# EAGLE schematic SLA_1500_CAM_V2 (EAGLE 9.2.1)
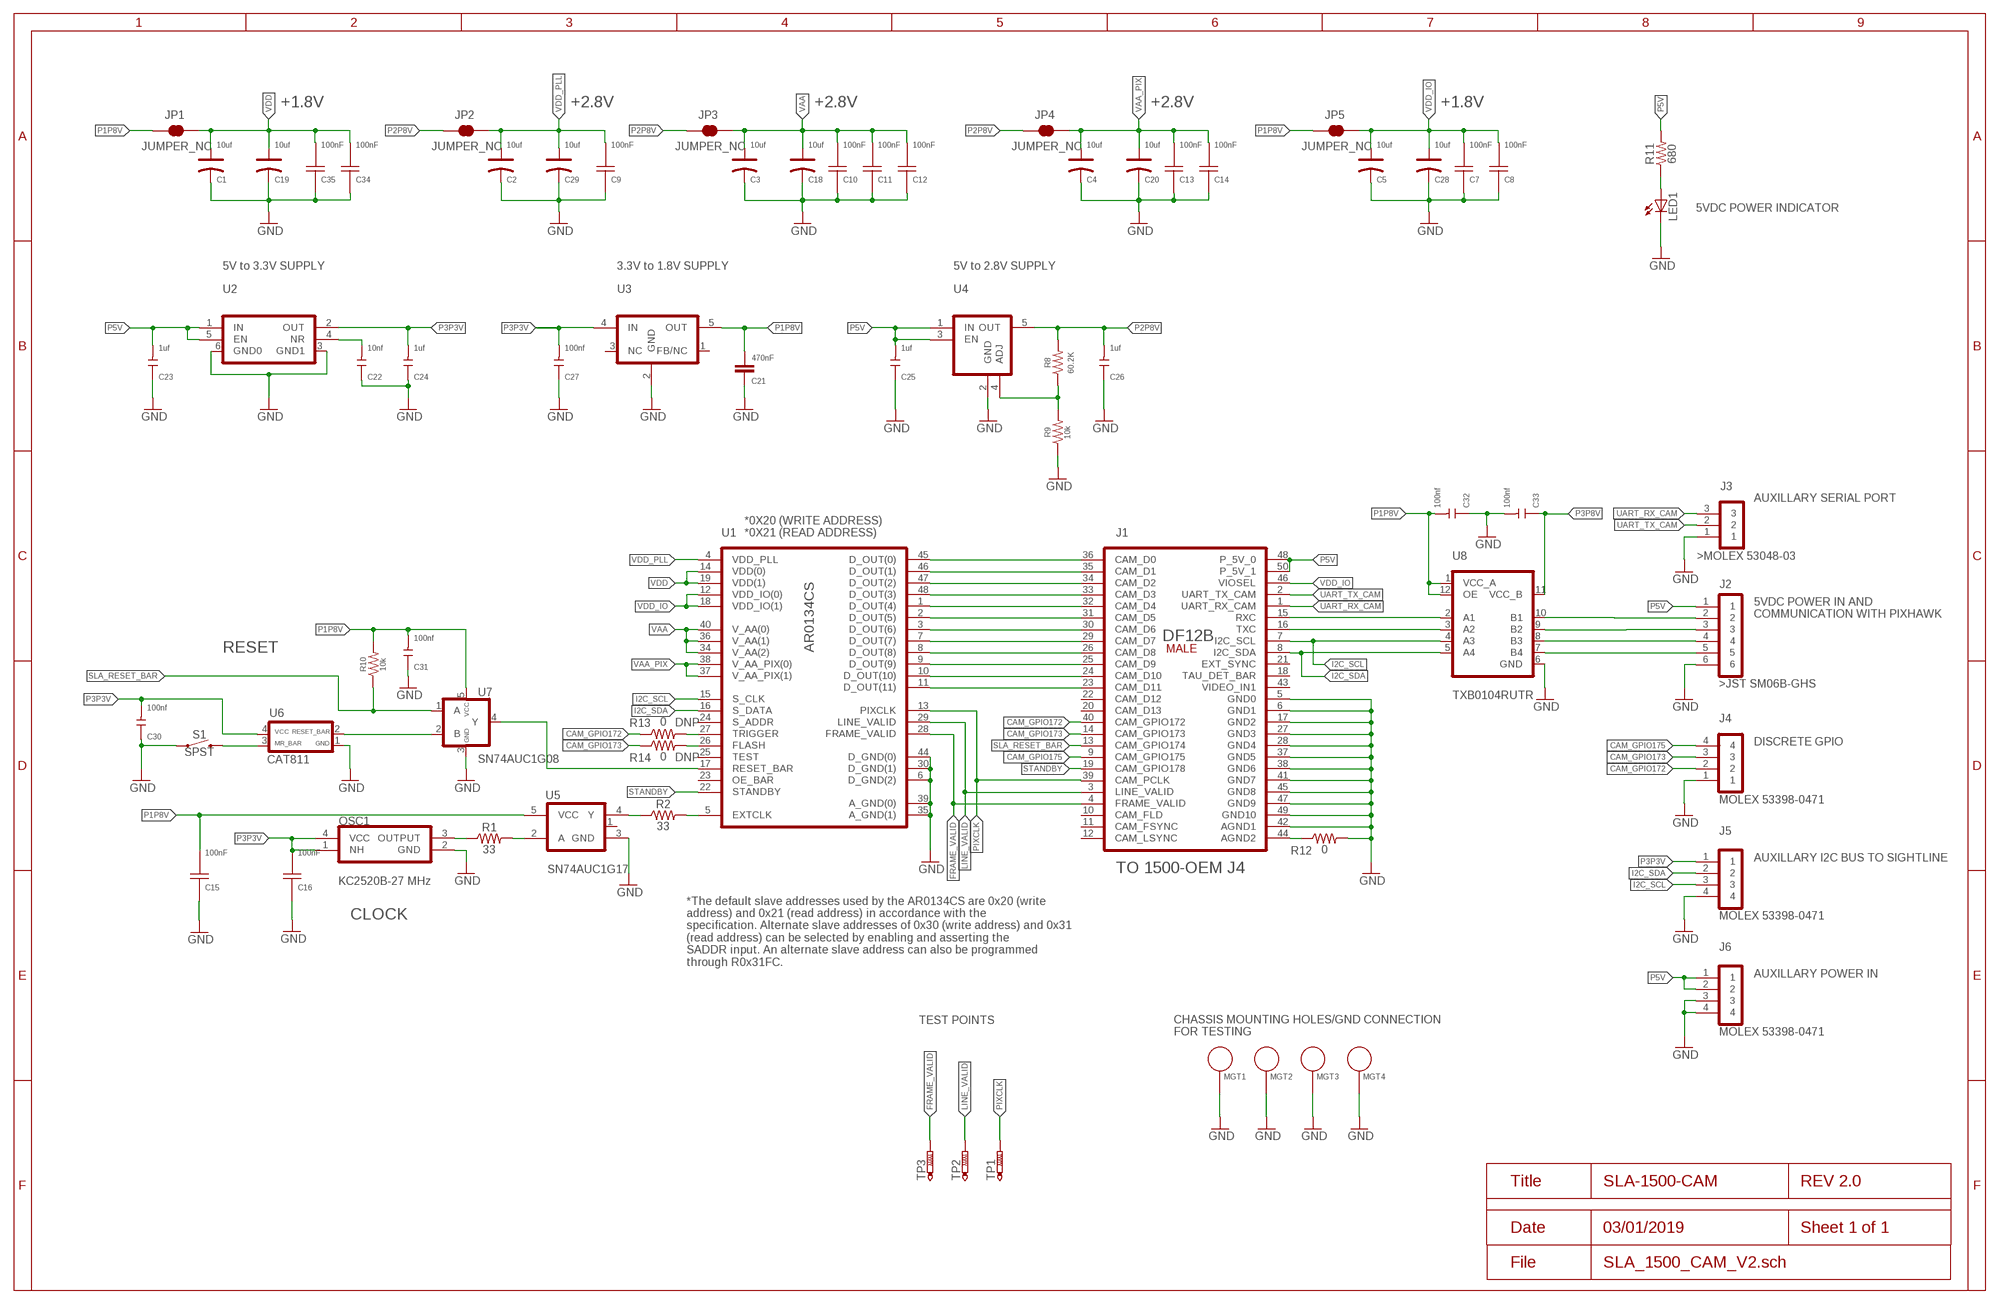
[diagram p0: schematic, sheet 1]
FRAME1 (FRAME_B_L): SPICEPREFIX: X

## Parts
C1  10uf  TANTALUM-SMD-10UF-10V-10%(AVX-A)  [AVX-A]
C2  10uf  TANTALUM-SMD-10UF-10V-10%(AVX-A)  [AVX-A]
C3  10uf  TANTALUM-SMD-10UF-10V-10%(AVX-A)  [AVX-A]
C4  10uf  TANTALUM-SMD-10UF-10V-10%(AVX-A)  [AVX-A]
C5  10uf  TANTALUM-SMD-10UF-10V-10%(AVX-A)  [AVX-A]
C7  CAP0201100NF  [R0201]
C8  CAP0201100NF  [R0201]
C9  CAP0201100NF  [R0201]
C10  CAP0201100NF  [R0201]
C11  CAP0201100NF  [R0201]
C12  CAP0201100NF  [R0201]
C13  CAP0201100NF  [R0201]
C14  CAP0201100NF  [R0201]
C15  CAP0201100NF  [R0201]
C16  CAP0201100NF  [R0201]
C18  10uf  TANTALUM-SMD-10UF-10V-10%(AVX-A)  [AVX-A]
C19  10uf  TANTALUM-SMD-10UF-10V-10%(AVX-A)  [AVX-A]
C20  10uf  TANTALUM-SMD-10UF-10V-10%(AVX-A)  [AVX-A]
C21  470nF  470NF-0402-16V-10%  [0402]
C22  10nf  CERAMIC-10NF-50V-10%-X7R(0402)  [C0402]
C23  1uf  CERAMIC-1UF-10V-10%-X5R(0402)  [C0402]
C24  1uf  CERAMIC-1UF-10V-10%-X5R(0402)  [C0402]
C25  1uf  CERAMIC-1UF-10V-10%-X5R(0402)  [C0402]
C26  1uf  CERAMIC-1UF-10V-10%-X5R(0402)  [C0402]
C27  100nf  CERAMIC-100NF-25V-10%-X7R(0402)  [C0402]
C28  10uf  TANTALUM-SMD-10UF-10V-10%(AVX-A)  [AVX-A]
C29  10uf  TANTALUM-SMD-10UF-10V-10%(AVX-A)  [AVX-A]
C30  100nf  CERAMIC-100NF-25V-10%-X7R(0402)  [C0402]
C31  100nf  CERAMIC-100NF-25V-10%-X7R(0402)  [C0402]
C32  100nf  CERAMIC-100NF-25V-10%-X7R(0402)  [C0402]
C33  100nf  CERAMIC-100NF-25V-10%-X7R(0402)  [C0402]
C34  CAP0201100NF  [R0201]
C35  CAP0201100NF  [R0201]
J1  DF12B(5.0)-50DS-0.5(86)SMT  [DF12B(5.0)-50DS-0.5V(86)]
J2  JST_GH_SM06B-GHS-TB  [JST_SM06B-GHS-TB]
J3  MOLEX_53048-03  [53048-03]
J4  MOLEX 53398-0471  MOLEX_53398-04  [53398-04]
J5  MOLEX 53398-04  MOLEX_53398-04  [53398-04]
J6  MOLEX_53398-04  [53398-04]
JP1  JUMPER_NC  JUMPER-SMT_2_NC_TRACE_SILK  [SMT-JUMPER_2_NC_TRACE_SILK]
JP2  JUMPER_NC  JUMPER-SMT_2_NC_TRACE_SILK  [SMT-JUMPER_2_NC_TRACE_SILK]
JP3  JUMPER_NC  JUMPER-SMT_2_NC_TRACE_SILK  [SMT-JUMPER_2_NC_TRACE_SILK]
JP4  JUMPER_NC  JUMPER-SMT_2_NC_TRACE_SILK  [SMT-JUMPER_2_NC_TRACE_SILK]
JP5  JUMPER_NC  JUMPER-SMT_2_NC_TRACE_SILK  [SMT-JUMPER_2_NC_TRACE_SILK]
LED1  LEDCHIP-LED0603  [CHIP-LED0603]
MGT1  MOUNTING_HOLE  [BEAGLEBONEBLACK_MOUNTING_HOLE]
MGT2  MOUNTING_HOLE  [BEAGLEBONEBLACK_MOUNTING_HOLE]
MGT3  MOUNTING_HOLE  [BEAGLEBONEBLACK_MOUNTING_HOLE]
MGT4  MOUNTING_HOLE  [BEAGLEBONEBLACK_MOUNTING_HOLE]
OSC1  KC2520B-27MHZ  [2.5X2.0_SMDCRYSTAL]
R1  33  RESISTOR0402  [0402]
R2  33  RESISTOR0402  [0402]
R8  60.2K  62KOHM-0603-1/10W-5%  [0603]
R9  10k  10KOHM-0603-1/10W-1%  [0603]
R10  10k  10KOHM-0603-1/10W-1%  [0603]
R11  680  680OHM-0603-1/10W-5%  [0603]
R12  0  RESISTOR0402  [0402]
R13  0  RESISTOR0402  [0402]
R14  0  RESISTOR0402  [0402]
S1  SPST  MOMENTARY-SWITCH-SPST-SMD-4.6X2.8MM  [TACTILE_SWITCH_SMD_4.6X2.8MM]
TP1  PTR1PAD1-13  [P1-13]
TP2  PTR1PAD1-13  [P1-13]
TP3  PTR1PAD1-13  [P1-13]
U1  AR0134CS-ILCC48  [ILCC48]
U2  TPS73633DCQR  [SOT-223-6-PIN]
U3  TPS71518DCKR  [TI-SC70-5]
U4  AP7331-WG-7  [SOT-25]
U5  SN74AUC1G17  [SOT23-5]
U6  CAT811  [SOT-143-4]
U7  SN74AUC1G08  [SOT23-5]
U8  TXB0104RUTR  [UQFN-12]

## Nets
CAM_GPIO172: J1.40(CAM_GPIO172) J4.2 R13.1
CAM_GPIO173: J1.14(CAM_GPIO173) J4.3 R14.1
CAM_GPIO175: J1.9(CAM_GPIO175) J4.4
FRAME_VALID: J1.4(FRAME_VALID) TP3.TP U1.28(FRAME_VALID)
GND: C1.- C2.- C3.- C4.- C5.- C7.2 C8.2 C9.2 C10.2 C11.2 C12.2 C13.2 C14.2 C15.2 C16.2 C18.- C19.- C20.- C21.2 C22.1 C23.1 C24.1 C25.1 C26.1 C27.1 C28.- C29.- C30.1 C31.1 C32.1 C33.2 C34.2 C35.2 J1.5(GND0) J1.6(GND1) J1.17(GND2) J1.27(GND3) J1.28(GND4) J1.37(GND5) J1.38(GND6) J1.41(GND7) J1.42(AGND1) J1.45(GND8) J1.47(GND9) J1.49(GND10) J2.6 J3.1 J4.1 J5.4 J6.3 J6.4 LED1.C MGT1.P$1 MGT2.P$1 MGT3.P$1 MGT4.P$1 OSC1.2(GND) R9.1 R12.2 S1.1 S1.2 U1.6(D_GND(2)) U1.30(D_GND(1)) U1.35(A_GND(1)) U1.39(A_GND(0)) U1.44(D_GND(0)) U2.3(GND1) U2.6(GND0) U3.2(GND) U4.2(GND) U5.3(GND) U6.1(GND) U7.3(GND) U8.6(GND)
I2C_SCL: J1.7(I2C_SCL) J5.3 U1.15(S_CLK) U8.4(A3)
I2C_SDA: J1.8(I2C_SDA) J5.2 U1.16(S_DATA) U8.5(A4)
LINE_VALID: J1.3(LINE_VALID) TP2.TP U1.29(LINE_VALID)
N$4: J1.23(CAM_D11) U1.11(D_OUT(11))
N$5: J1.24(CAM_D10) U1.10(D_OUT(10))
N$6: J1.25(CAM_D9) U1.9(D_OUT(9))
N$7: J1.26(CAM_D8) U1.8(D_OUT(8))
N$8: J1.29(CAM_D7) U1.7(D_OUT(7))
N$9: J1.30(CAM_D6) U1.3(D_OUT(6))
N$10: J1.31(CAM_D5) U1.2(D_OUT(5))
N$11: J1.32(CAM_D4) U1.1(D_OUT(4))
N$12: J1.33(CAM_D3) U1.48(D_OUT(3))
N$14: J1.34(CAM_D2) U1.47(D_OUT(2))
N$15: R1.2 U5.2(A)
N$16: OSC1.3(OUTPUT) R1.1
N$17: J1.15(RXC) U8.2(A1)
N$18: J2.3 U8.9(B2)
N$19: J2.5 U8.7(B4)
N$20: J2.2 U8.10(B1)
N$21: C22.2 U2.4(NR)
N$22: J1.35(CAM_D1) U1.46(D_OUT(1))
N$23: R8.1 R9.2 U4.4(ADJ)
N$24: J1.36(CAM_D0) U1.45(D_OUT(0))
N$25: R2.1 U5.4(Y)
N$26: R2.2 U1.5(EXTCLK)
N$27: S1.3 S1.4 U6.3(MR_BAR)
N$28: U6.2(RESET_BAR) U7.2(B)
N$29: U1.17(RESET_BAR) U7.4(Y)
N$30: LED1.A R11.1
N$31: J1.44(AGND2) R12.1
N$32: R13.2 U1.27(TRIGGER)
N$33: R14.2 U1.26(FLASH)
N$34: J1.16(TXC) U8.3(A2)
N$36: J2.4 U8.8(B3)
P1P8V: C15.1 C21.1 C31.2 C32.2 JP1.1 JP5.1 R10.2 U3.5(OUT) U5.5(VCC) U7.5(VCC) U8.1(VCC_A) U8.12(OE)
P2P8V: C26.2 JP2.1 JP3.1 JP4.1 R8.2 U4.5(OUT)
P3P3V: C16.1 C24.2 C27.2 C30.2 J5.1 OSC1.1(NH) OSC1.4(VCC) U2.2(OUT) U3.4(IN) U6.4(VCC)
P3P8V: C33.1 U8.11(VCC_B)
P5V: C23.2 C25.2 J1.48(P_5V_0) J1.50(P_5V_1) J2.1 J6.1 J6.2 R11.2 U2.1(IN) U2.5(EN) U4.1(IN) U4.3(EN)
PIXCLK: J1.39(CAM_PCLK) TP1.TP U1.13(PIXCLK)
SLA_RESET_BAR: J1.13(CAM_GPIO174) R10.1 U7.1(A)
STANDBY: J1.19(CAM_GPIO178) U1.22(STANDBY)
UART_RX_CAM: J1.1(UART_RX_CAM) J3.3
UART_TX_CAM: J1.2(UART_TX_CAM) J3.2
VAA: C3.+ C10.1 C11.1 C12.1 C18.+ JP3.2 U1.34(V_AA(2)) U1.36(V_AA(1)) U1.40(V_AA(0))
VAA_PIX: C4.+ C13.1 C14.1 C20.+ JP4.2 U1.37(V_AA_PIX(1)) U1.38(V_AA_PIX(0))
VDD: C1.+ C19.+ C34.1 C35.1 JP1.2 U1.14(VDD(0)) U1.19(VDD(1))
VDD_IO: C5.+ C7.1 C8.1 C28.+ J1.46(VIOSEL) JP5.2 U1.12(VDD_IO(0)) U1.18(VDD_IO(1))
VDD_PLL: C2.+ C9.1 C29.+ JP2.2 U1.4(VDD_PLL)
Unconnected: J1.10(CAM_FLD) J1.11(CAM_FSYNC) J1.12(CAM_LSYNC) J1.18(TAU_DET_BAR) J1.20(CAM_D13) J1.21(EXT_SYNC) J1.22(CAM_D12) J1.43(VIDEO_IN1) U1.23(OE_BAR) U1.24(S_ADDR) U1.25(TEST) U3.1(FB/NC) U3.3(NC) U5.1(NC)

## Notes on the sheet
- +1.8V | +2.8V | +2.8V | +2.8V | +1.8V
- 5VDC POWER INDICATOR
- 5V to 3.3V SUPPLY | 3.3V to 1.8V SUPPLY | 5V to 2.8V SUPPLY
- AUXILLARY SERIAL PORT
- *0X20 (WRITE ADDRESS)
  *0X21 (READ ADDRESS)
- 5VDC POWER IN AND 
  COMMUNICATION WITH PIXHAWK
- RESET
- DNP
- DISCRETE GPIO
- DNP
- MOLEX 53398-0471
- AUXILLARY I2C BUS TO SIGHTLINE
- TO 1500-OEM J4
- CLOCK | MOLEX 53398-0471
- *The default slave addresses used by the AR0134CS are 0x20 (write
  address) and 0x21 (read address) in accordance with the
  specification. Alternate slave addresses of 0x30 (write address) and 0x31 
  (read address) can be selected by enabling and asserting the
  SADDR input. An alternate slave address can also be programmed
  through R0x31FC.
- AUXILLARY POWER IN
- TEST POINTS
- CHASSIS MOUNTING HOLES/GND CONNECTION
  FOR TESTING
- MOLEX 53398-0471

## Library data of the parts
C1-C5 C18-C20 C28 C29 = Seeed-Capacitor:TANTALUM-SMD-10UF-10V-10%(AVX-A): 302020011; MPN: TAJA106K010RNJ
C7-C16 C34 C35 = Sightline:CAP0201: CAP0201 PANASONIC CERAMIC CAPACITOR CAP, CERAMIC, 100nF, 10V, X5R, 20%, 0201; DESCRIPTION: CAP, CERAMIC, 100nF, 10V, X5R, 20%, 0201; MANF: PANASONIC; MANF#: ECJZEB1A104M
C21 = SparkFun-Capacitors:470NF: 0.47uF/470nF ceramic capacitors A capacitor is a passive two-terminal electrical component used to store electrical energy temporarily in an electric field.; PROD_ID: CAP-09041
C22 = Seeed-Capacitor:CERAMIC-10NF-50V-10%-X7R(0402): 302010006; MPN: CC0402KRX7R9BB103
C23-C26 = Seeed-Capacitor:CERAMIC-1UF-10V-10%-X5R(0402): 302010040; MPN: CC0402KRX5R6BB105
C27 C30-C33 = Seeed-Capacitor:CERAMIC-100NF-25V-10%-X7R(0402): 302010024; MPN: CC0402KRX7R8BB104
J1 = Sightline:DF12B(5.0)-50DS-0.5(86): DF12B(5.0)-50DS-0.5(86) DF12 Series 0.5 mm Pitch SMT Board-to-Board Connector (MALE) Specifications Manufacturer: Hirose Manufacturer Part Number: 537-0309-6 86 Operating Temperature Range(C): -45 - 125 Current Rating: 0.3A Voltage Rating: 50V AC Body Size(mm): 14.6 x 3.6 DF12B(5.0)-50DS DATASHEET <https://www.hirose.com/product/en/products/DF12/> Created by: Kimball S. Davis kimball4@pdx.edu <mailto: kimball4@pdx.edu> 21 January 2019 Version 001; DESCRIPTION: DF12B-50DS-0.5V(86) Hirose Male 50-pin connector; MANF: Hirose; MANF#: 537-0309-6 86
J2 = Sightline:JST_GH_SM06B-GHS-TB: JST SM06B-GHS-TB JST Type GH 1.25mm side-entry smt 6-pin connector Specifications Manufacturer: JST Manufacturer Part Number: SM06B-GHS-TB Body Size(mm): 10.75 X 4.25 JST TYPE GH DATASHEET <http://www.jst-mfg.com/product/pdf/eng/eGH.pdf> Created by: Kimball S. Davis 5 February 2019 Version 001; DESCRIPTION: 1.25 MM SIDE-ENTRY 6-PIN SMT CONNECTOR; MANF: JST; MANF#: SM06B-GHS-TB
J3 = Sightline:MOLEX_53048-03; DESCRIPTION: MOLEX 53048-03 3-PIN CONNECTOR; MANF: MOLEX; MANF#: 53048-0310
J4-J6 = Sightline:MOLEX_53398-04: MOLEX 53398-0471 1.25mm Pitch PicoBlade Header, Surface Mount, Vertical, 4 Circuits MOLEX 53398-0471 DATASHEET <https://www.molex.com/webdocs/datasheets/pdf/en-us/0533980471_PCB_HEADERS.pdf>; DESCRIPTION: MOLEX 53398-04 4-PIN SMT CONNECTOR; MANF: MOLEX; MANF#: 53398-0471
JP1-JP5 = SparkFun-Jumpers:JUMPER-SMT_2_NC_TRACE: Normally closed trace jumper This jumper has a trace between two pads so it's normally closed (NC). Use a razor knife to open the connection. For best results follow the IPC guidelines for cutting traces: Cutout at least 0.063 mm (0.005 in). Remove all loose material to clean up the cut area. Seal the cut with an approved epoxy. Reapply solder to reclose the connection.
LED1 = led:LED: LED OSRAM: - CHIPLED LG R971, LG N971, LY N971, LG Q971, LY Q971, LO R971, LY R971 LH N974, LH R974 LS Q976, LO Q976, LY Q976 LO Q996 - Hyper CHIPLED LW Q18S LB Q993, LB Q99A, LB R99A - SideLED LS A670, LO A670, LY A670, LG A670, LP A670 LB A673, LV A673, LT A673, LW A673 LH A674 LY A675 LS A676, LA A676, LO A676, LY A676, LW A676 LS A679, LY A679, LG A679 - Hyper Micro SIDELED® LS Y876, LA Y876, LO Y876, LY Y876 LT Y87S - SmartLED LW L88C, LW L88S LB L89C, LB L89S, LG L890 LS L89K, LO L89K, LY L89K LS L896, LA L896, LO L896, LY L896 - TOPLED LS T670, LO T670, LY T670, LG T670, LP T670 LSG T670, LSP T670, LSY T670, LOP T670, LYG T670 LG T671, LOG T671, LSG T671 LB T673, LV T673, LT T673, LW T673 LH T674 LS T676, LA T676, LO T676, LY T676, LB T676, LH T676, LSB T676, LW T676 LB T67C, LV T67C, LT T67C, LS T67K, LO T67K, LY T67K, LW E67C LS E67B, LA E67B, LO E67B, LY E67B, LB E67C, LV E67C, LT E67C LW T67C LS T679, LY T679, LG T679 LS T770, LO T770, LY T770, LG T770, LP T770 LB T773, LV T773, LT T773, LW T773 LH T774 LS E675, LA E675, LY E675, LS T675 LS T776, LA T776, LO T776, LY T776, LB T776 LHGB T686 LT T68C, LB T68C - Hyper Mini TOPLED® LB M676 - Mini TOPLED Santana® LG M470 LS M47K, LO M47K, LY M47K Source: http://www.osram.convergy.de LUXEON: - LUMILED® LXK2-PW12-R00, LXK2-PW12-S00, LXK2-PW14-U00, LXK2-PW14-V00 LXK2-PM12-R00, LXK2-PM12-S00, LXK2-PM14-U00 LXK2-PE12-Q00, LXK2-PE12-R00, LXK2-PE12-S00, LXK2-PE14-T00, LXK2-PE14-U00 LXK2-PB12-K00, LXK2-PB12-L00, LXK2-PB12-M00, LXK2-PB14-N00, LXK2-PB14-P00, LXK2-PB14-Q00 LXK2-PR12-L00, LXK2-PR12-M00, LXK2-PR14-Q00, LXK2-PR14-R00 LXK2-PD12-Q00, LXK2-PD12-R00, LXK2-PD12-S00 LXK2-PH12-R00, LXK2-PH12-S00 LXK2-PL12-P00, LXK2-PL12-Q00, LXK2-PL12-R00 Source: www.luxeon.com KINGBRIGHT: KA-3528ASYC Source: www.kingbright.com
MGT1-MGT4 = BeagleBone_Blue_R3:MOUNTING_HOLE: Chassis Mounting Hole w/GND connection ability
OSC1 = Sightline:KC2520B-27MHZ: KC2520B-27MHz-2.5X2.0 27 MHz SMT Clock Oscillator with CMOS output Specifications Manufacturer: Kyocera Manufacturer Part Number: KC2520B27.0000C2GE00 Supply Voltage: 1.8 to 3.3V Body Size(mm): 2.5 x 2.0 KC2520B DATASHEET <https://www.mouser.com/datasheet/2/909/kc2520b_c1_e-1388834.pdf> Created by: Kimball S. Davis 25 January 2019 Version 001; DESCRIPTION: OSC, CRYSTAL CLOCK, SMD, CMOS, 2.25V TO 3.63V, 4mA, 27.0000MHz, 2.5MM x 2.0MM; MANF: Kyocera; MANF#: KC2520B27.0000C2GE00
R1 R2 R12-R14 = SparkFun-Resistors:RESISTOR: Generic Resistor Package
R8 = SparkFun-Resistors:62KOHM: 62kΩ resistor A resistor is a passive two-terminal electrical component that implements electrical resistance as a circuit element. Resistors act to reduce current flow, and, at the same time, act to lower voltage levels within circuits. - Wikipedia
R9 R10 = SparkFun-Resistors:10KOHM: 10kΩ resistor A resistor is a passive two-terminal electrical component that implements electrical resistance as a circuit element. Resistors act to reduce current flow, and, at the same time, act to lower voltage levels within circuits. - Wikipedia; PROD_ID: RES-00824
R11 = SparkFun-Resistors:680OHM: 680Ω resistor A resistor is a passive two-terminal electrical component that implements electrical resistance as a circuit element. Resistors act to reduce current flow, and, at the same time, act to lower voltage levels within circuits. - Wikipedia; PROD_ID: RES-09333
S1 = SparkFun-Switches:MOMENTARY-SWITCH-SPST: Momentary Switch (Pushbutton) - SPST Normally-open (NO) SPST momentary switches (buttons, pushbuttons). Variants PTH-12MM - 12mm square, through-hole Momentary Pushbutton Switch - 12mm Square <https://www.sparkfun.com/products/9190> (COM-09190) PTH-6.0MM, PTH-6.0MM-KIT - 6.0mm square, through-hole Mini Pushbutton Switch <https://www.sparkfun.com/products/97> (COM-00097) KIT package intended for soldering kit's - only one side of pads' copper is exposed. PTH-RIGHT-ANGLE-KIT - Right-angle, through-hole Right Angle Tactile Button <https://www.sparkfun.com/products/10791> - Used on SparkFun BigTime Watch Kit <https://www.sparkfun.com/products/11734> SMD-12MM - 12mm square, surface-mount Tactile Button - SMD (12mm) <https://www.sparkfun.com/products/12993> (COM-12993) Used on SparkFun PicoBoard <https://www.sparkfun.com/products/11888> SMD-4.5MM - 4.5mm Square Trackball Switch Used on SparkFun Blackberry Trackballer Breakout <https://www.sparkfun.com/products/13169> SMD-4.6MMX2.8MM - 4.60mm x 2.80mm, surface mount Used on SparkFun SAMD21 Mini Breakout <https://www.sparkfun.com/products/13664> SMD-5.2MM, SMD-5.2-REDUNDANT - 5.2mm square, surface-mount Mini Pushbutton Switch - SMD <https://www.sparkfun.com/products/8720> (COM-08720) Used on Arduino Pro Mini <https://www.sparkfun.com/products/11114> REDUNDANT package connects both switch circuits together SMD-6.0X3.5MM - 6.0 x 3.5mm, surface mount Momentary Reset Switch SMD <https://www.sparkfun.com/products/8229> (COM-08229) SMD-6.2MM-TALL - 6.2mm square, surface mount Tactile Button - SMD (6mm) <https://www.sparkfun.com/products/12992> Used on SparkFun Digital Sandbox <https://www.sparkfun.com/products/12651> SMD-RIGHT-ANGLE - Right-angle, surface mount Used on SparkFun Block for Intel® Edison - Arduino <https://www.sparkfun.com/products/13036>; PROD_ID: SWCH-13065
TP1-TP3 = testpad:PTR1: TEST PIN
U1 = Sightline:AR0134CS-ILCC48: AR0134CS-1LCC48-10x10 1/3-inch 1.2 Mp CMOS digital image sensor with an active-pixel array of 1280 (H) × 960 (V) Specifications Manufacturer: On Semiconductor Manufacturer Part Number: AR0134CSSM00SPCA0 Operating Temperature Range(C): -30 - 70 Supply Voltage: I/O: 1.8 or 2.8V Digital: 1.8V Analog: 2.8V HiSPi: 0.4V Body Size(mm): 10 x 10 ARO134CS DATASHEET <https://www.onsemi.com/pub/Collateral/AR0134CS-D.PDF> Created by: Kimball S. Davis kimball4@pdx.edu <mailto: kimball4@pdx.edu> 22 January 2019 Version 001; DESCRIPTION: 1/3-inch 1.2 Mp CMOS digital image sensor with an active-pixel array of 1280 (H) × 960 (V); MANF: On Semiconductor; MANF#: AR0134CSSM00SPCA0
U2 = Sightline:TPS73633DCQR: TPS73633DCQR Cap-Free, NMOS, 400-mA Low-Dropout Regulator with Reverse Current Protection 5.5 to 3.3V, SOT-223 6-pin, 6.5 x 3.5 mm TPS73633DCQR DATASHEET <http://www.ti.com/lit/ds/symlink/tps736.pdf>; DESCRIPTION: Cap-Free, NMOS, 400-mA Low-Dropout Regulator with Reverse Current Protection 5.5 to 3.3V, SOT-223 6-pin, 6.5 x 3.5 mm; MANF: TEXAS INSTRUMENTS; MANF#: TPS73633DCQR
U3 = Sightline:TPS71518DCKR: TPS71518DCKR 50-mA, 24-V, 3.2-μA Supply Current Low-Dropout Linear Regulator in SC70 5-Pin Package, 3.3 to 1.8V, 2.15 x 1.4mm TPS71518DCKR DATASHEET <http://www.ti.com/lit/ds/symlink/tps715.pdf>; DESCRIPTION: 50-mA, 24-V, 3.2-μA Supply Current Low-Dropout Linear Regulator in SC70 5-Pin Package, 3.3 to 1.8V, 2.15 x 1.4mm; MANF: TEXAS INSTRUMENTS; MANF#: TPS71518DCKR
U4 = Sightline:AP7331-WG-7: AP7331-WG-7 300mA, LOW QUIESCENT CURRENT, FAST TRANSIENT LOW DROPOUT LINEAR REGULATOR, ADJUSTABLE OUTPUT, 5V to 2.8V, 3.1 x 1.7mm AP7331 DATASHEET <https://www.diodes.com/assets/Datasheets/AP7331.pdf>; DESCRIPTION: 300mA, LOW QUIESCENT CURRENT, FAST TRANSIENT LOW DROPOUT LINEAR REGULATOR, ADJUSTABLE OUTPUT, 5V to 2.8V, 3.1 x 1.7mm; MANF: DIODES INCORPORATED; MANF#: AP7331-WG-7
U5 = Sightline:SN74AUC1G17: SN74AUC1G17-SOT23-5 IC, BUFFER, SINGLE SCHMITT-TRIGGER, 9mA, 0.8V TO 2.7V, SOT23-5 Specifications Manufacturer: Texas Instruments Manufacturer Part Number: SN74AUC1G17DBVR Supply Voltage: 3.6V Max Body Size(mm): 2.9 x 1.6 SN74AUC1G17 DATASHEET <http://www.ti.com/lit/ds/symlink/sn74auc1g17.pdf> Created by: Kimball S. Davis 24 January 2019 Version 001; DESCRIPTION: IC, BUFFER, SINGLE SCHMITT-TRIGGER, 9mA, 0.8V TO 2.7V, SOT23-5; MANF: TEXAS INSTRUMENTS; MANF#: SN74AUC1G17DBV
U6 = Sightline:CAT811: CAT811-SOT-143-4 IC, SUPERVISOR, MICROPROCESSOR POWER SUPPLY, 2.93V, ACTIVE LOW RESET, SOT143-4 Specifications Manufacturer: On Semiconductor Manufacturer Part Number: CAT811STBI Body Size(mm): 2.9 x 1.3 CAT811 DATASHEET <https://www.onsemi.com/pub/Collateral/CAT811-D.PDF> Created by: Kimball S. Davis 23 January 2019 Version 001; DESCRIPTION: IC, SUPERVISOR, MICROPROCESSOR POWER SUPPLY, 2.93V, ACTIVE LOW RESET, SOT143-4; MANF: On Semiconductor; MANF#: CAT811STBI
U7 = Sightline:SN74AUC1G08: SN74AUC1G08-SOT23-5 Single 2-Input Positive-AND Gate Specifications Manufacturer: Texas Instruments Manufacturer Part Number: SN74AUC1G08DBVR Supply Voltage: 1.65 - 1.95V Body Size(mm): 2.9 x 1.6 SN74AUC1G08 DATASHEET <http://www.ti.com/lit/ds/symlink/sn74auc1g08.pdf>; DESCRIPTION: IC, AND GATE, SINGLE, 2 INPUT POSITIVE, SGL, SOT23-5; MANF: Texas Instruments; MANF#: SN74AUC1G08DBVR
U8 = Sightline:TXB0104RUTR: TXB0104RUTR TXB0104 4-Bit Bidirectional Voltage-level Translator With Automatic Direction Sensing and ±15-kV ESD Protection TXB0104RUTR DATASHEET <http://www.ti.com/lit/ds/symlink/txb0104.pdf>; DESCRIPTION: TXB0104 4-Bit Bidirectional Voltage-level Translator With Automatic Direction Sensing and ±15-kV ESD Protection; MANF: Texas Instruments; MANF#: TXB0104RUTR